# Altium schematic sheet ESP32 with USBC.SchDoc (part 3 of 3)
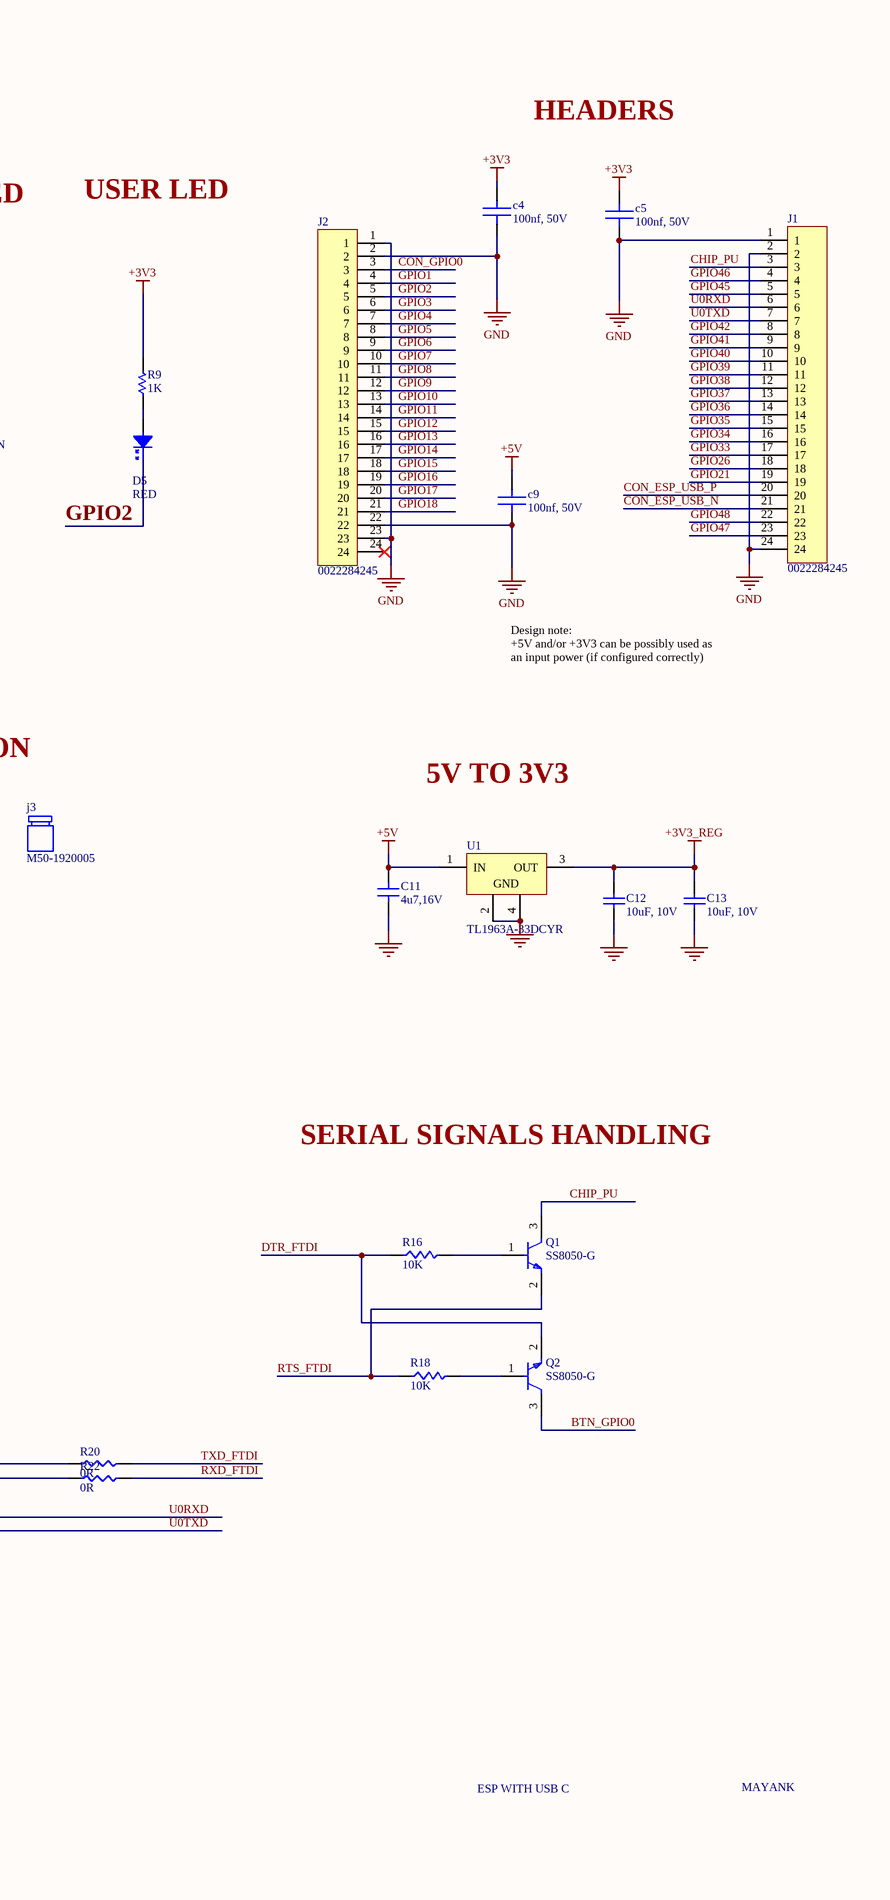
[diagram p3: ESP32 with USBC.SchDoc, right]

## Library data of the parts (continued)
R6 R9 = RC0402FR-071KL: RES 1K OHM 1% 1/16W 0402; Manufacturer: Yageo Group; Value: 1kΩ; Temperature Coefficient: 100ppm/°C; Working Voltage: 50V; Power Rating: 62.5mW; Supplier: DigiKey; Supplier Part Number: 311-1.00KLRDKR-ND; Manufacturer Part Number: RC0402FR-071KL; RoHS: Compliant; Category: Chip SMD Resistors; Stock: 9104095; Pricing: 1=0.1, 10=0.021, 25=0.0152, 50=0.012, 100=0.0097, 250=0.0074, 500=0.00612, 1000=0.00512, 5000=0.00355 (USD); Mounting Technology: Surface Mount; Pins: 2; Case/Package: 0402; Min Operating Temperature: -55°C; Max Operating Temperature: 155°C; Tolerance: 1%; Packaging: Tape & Reel; Termination: SMD/SMT; ComponentLink1URL: https://datasheet.octopart.com:443/RC0402FR-071KL-Yageo-datasheet-175887523.pdf?src-supplier=Newark; ComponentLink1Description: https://datasheet.octopart.com:443/RC0402FR-071KL-Yageo-datasheet-175887523.pdf?src-supplier=Newark; ComponentLink2URL: https://datasheet.octopart.com:443/RC0402FR-071KL-Yageo-datasheet-10408619.pdf?src-supplier=Newark; ComponentLink2Description: https://datasheet.octopart.com:443/RC0402FR-071KL-Yageo-datasheet-10408619.pdf?src-supplier=Newark; ComponentLink3URL: https://datasheet.octopart.com:443/RC0402FR-071KL-Yageo-datasheet-8324527.pdf?src-supplier=Newark; ComponentLink3Description: https://datasheet.octopart.com:443/RC0402FR-071KL-Yageo-datasheet-8324527.pdf?src-supplier=Newark; ComponentLink4URL: https://datasheet.octopart.com:443/RC0402FR-071KL-Yageo-datasheet-164759695.pdf?src-supplier=Upverter; ComponentLink4Description: https://datasheet.octopart.com:443/RC0402FR-071KL-Yageo-datasheet-164759695.pdf?src-supplier=Upverter; ComponentLink5URL: https://datasheet.octopart.com:443/RC0402FR-071KL-Yageo-datasheet-103092701.pdf?src-supplier=Upverter; ComponentLink5Description: https://datasheet.octopart.com:443/RC0402FR-071KL-Yageo-datasheet-103092701.pdf?src-supplier=Upverter; ComponentLink6URL: https://sigma.octopart.com:443/138820526/technical_drawing/Yageo-RC0402FR-071KL.pdf?src-supplier=Upverter; ComponentLink6Description: https://sigma.octopart.com:443/138820526/technical_drawing/Yageo-RC0402FR-071KL.pdf?src-supplier=Upverter; ComponentLink7URL: https://datasheet.octopart.com:443/RC0402FR-071KL-Yageo-datasheet-98239111.pdf?src-supplier=Upverter; ComponentLink7Description: https://datasheet.octopart.com:443/RC0402FR-071KL-Yageo-datasheet-98239111.pdf?src-supplier=Upverter; ComponentLink8URL: https://datasheet.octopart.com:443/RC0402FR-071KL-Yageo-Group-datasheet-190305687.pdf?src-supplier=Future+Electronics; ComponentLink8Description: https://datasheet.octopart.com:443/RC0402FR-071KL-Yageo-Group-datasheet-190305687.pdf?src-supplier=Future+Electronics; LCSC Part Number: C106235; Case Code (Imperial): 0402; Case Code (Metric): 0402; China RoHS: Non-Compliant; Composition: Thick Film; Contact Plating: Tin; Depth: 500µm; Height: 350µm; Lead Free: Lead Free; Length: 1mm; Lifecycle Status: Production; Military Standard: Not; Number of Terminals: 2; Radiation Hardening: No; REACH SVHC: Yes; Schedule B: 8533210045, 8533210045|8533210045|8533210045|8533210045|8533210045|8533210045|8533210045|8533210045|8533210045|8533210045|8533210045|8533210045|8533210045|8533210045|8533210045|8533210045|8533210045|8533210045|8533210045|8533210045|8533210045|8533210045|8533210045|85; Voltage Rating: 50V; Voltage Rating (AC): 50V; Voltage Rating (DC): 50V; Width: 500µm; ComponentLink9URL: https://datasheet.octopart.com:443/RC0402FR-071KL-Yageo-datasheet-12531192.pdf?src-supplier=Future+Electronics; ComponentLink9Description: https://datasheet.octopart.com:443/RC0402FR-071KL-Yageo-datasheet-12531192.pdf?src-supplier=Future+Electronics; ComponentLink10URL: https://datasheet.octopart.com:443/RC0402FR-071KL-Yageo-datasheet-137700087.pdf?src-supplier=Future+Electronics; ComponentLink10Description: https://datasheet.octopart.com:443/RC0402FR-071KL-Yageo-datasheet-137700087.pdf?src-supplier=Future+Electronics; ComponentLink11URL: https://datasheet.octopart.com:443/RC0402FR-071KL-Yageo-datasheet-8324255.pdf?src-supplier=Future+Electronics; ComponentLink11Description: https://datasheet.octopart.com:443/RC0402FR-071KL-Yageo-datasheet-8324255.pdf?src-supplier=Future+Electronics; ComponentLink12URL: https://datasheet.octopart.com:443/RC0402FR-071KL-Yageo-datasheet-62067350.pdf?src-supplier=Farnell; ComponentLink12Description: https://datasheet.octopart.com:443/RC0402FR-071KL-Yageo-datasheet-62067350.pdf?src-supplier=Farnell; ComponentLink13URL: https://datasheet.octopart.com:443/RC0402FR-071KL-Yageo-datasheet-8329306.pdf?src-supplier=element14; ComponentLink13Description: https://datasheet.octopart.com:443/RC0402FR-071KL-Yageo-datasheet-8329306.pdf?src-supplier=element14; ComponentLink14URL: https://datasheet.octopart.com:443/RC0402FR-071KL-Yageo-datasheet-505231.pdf?src-supplier=element14; ComponentLink14Description: https://datasheet.octopart.com:443/RC0402FR-071KL-Yageo-datasheet-505231.pdf?src-supplier=element14; ComponentLink15URL: https://datasheet.octopart.com:443/RC0402FR-071KL-Yageo-datasheet-175423674.pdf?src-supplier=SOS+electronic; ComponentLink15Description: https://datasheet.octopart.com:443/RC0402FR-071KL-Yageo-datasheet-175423674.pdf?src-supplier=SOS+electronic; ComponentLink16URL: https://datasheet.octopart.com:443/RC0402FR-071KL-Yageo-datasheet-148775077.pdf?src-supplier=TME; ComponentLink16Description: https://datasheet.octopart.com:443/RC0402FR-071KL-Yageo-datasheet-148775077.pdf?src-supplier=TME; ComponentLink17URL: https://datasheet.octopart.com:443/RC0402FR-071KL-Yageo-datasheet-79472498.pdf?src-supplier=Megastar; ComponentLink17Description: https://datasheet.octopart.com:443/RC0402FR-071KL-Yageo-datasheet-79472498.pdf?src-supplier=Megastar; ComponentLink18URL: https://datasheet.octopart.com/RC0402FR-071KL-Yageo-datasheet-73766026.pdf; ComponentLink18Description: https://datasheet.octopart.com/RC0402FR-071KL-Yageo-datasheet-73766026.pdf; ComponentLink19URL: http://sigma.octopart.com:80/conflict_mineral_statement/Yageo-company-3.pdf?src-supplier=Compliance+Statements; ComponentLink19Description: http://sigma.octopart.com:80/conflict_mineral_statement/Yageo-company-3.pdf?src-supplier=Compliance+Statements; ComponentLink20URL: http://sigma.octopart.com:80/rohs_statement/Yageo-company-2.pdf?src-supplier=Compliance+Statements; ComponentLink20Description: http://sigma.octopart.com:80/rohs_statement/Yageo-company-2.pdf?src-supplier=Compliance+Statements
R8 = RC0402FR-074K7L: RES 4.7K OHM 1% 1/16W 0402; Manufacturer: Yageo; Additional Feature: LASER TRIMMABLE; Power: 62.5mW; Rated Temperature: 70°C; Value: 4.7kR; Temperature Coefficient: 100ppm/°C; Working Voltage: 50V; Package Height: 0.35mm; Package Length: 1mm; Package Width: 0.5mm; Supplier: Digikey; Supplier Part Number: 311-4.7KLRCT-ND; Manufacturer Part Number: RC0402FR-074K7L; RoHS: Yes; Category: Chip SMD Resistors; Stock: 9886878; Pricing: 1=0.1, 10=0.015, 50=0.0088, 100=0.0073, 500=0.00488, 1000=0.00417, 5000=0.00297 (USD); Mounting Technology: Surface Mount; Pins: 2; Package Shape: Rectangular; Case/Package: 0402; Terminal Finish: Nickel; Min Operating Temperature: -55°C; Max Operating Temperature: 155°C; Tolerance: 1%; JESD-609 Code: e3; Resistor Type: FIXED RESISTOR; Construction: Chip; Package Style: SMTMeter; Packaging: Tape and Reel; Technology: METAL GLAZE/THICK FILM; Termination: Wraparound; Reach SVHC Compliant: Yes; RoHS Compliant: Yes; ComponentLink1URL: https://datasheet.ciiva.com:443/pdfs/VipMasterIC/IC/YAGO/YAGO-S-A0008145938/YAGO-S-A0008145938-1.pdf?src-supplier=IHS+Markit; ComponentLink1Description: https://datasheet.ciiva.com:443/pdfs/VipMasterIC/IC/YAGO/YAGO-S-A0008145938/YAGO-S-A0008145938-1.pdf?src-supplier=IHS+Markit; ComponentLink2URL: https://datasheet.ciiva.com/22661/1686128-22661342.pdf?src-supplier=Element14; ComponentLink2Description: https://datasheet.ciiva.com/22661/1686128-22661342.pdf?src-supplier=Element14; ComponentLink3URL: https://datasheet.ciiva.com/7850/1018594-7850022.pdf?src-supplier=Element14; ComponentLink3Description: https://datasheet.ciiva.com/7850/1018594-7850022.pdf?src-supplier=Element14; ComponentLink4URL: https://datasheet.ciiva.com/7850/1018594-7850023.pdf?src-supplier=Element14; ComponentLink4Description: https://datasheet.ciiva.com/7850/1018594-7850023.pdf?src-supplier=Element14; ComponentLink5URL: https://datasheet.ciiva.com/15215/getdatasheetpartid-328119-15215035.pdf?src-supplier=Verical; ComponentLink5Description: https://datasheet.ciiva.com/15215/getdatasheetpartid-328119-15215035.pdf?src-supplier=Verical; LCSC Part Number: C105871
R10 = AC0402FR-0710KL: RES SMD 10K OHM 1% 1/16W 0402; Manufacturer: Yageo Group; Max Power Dissipation: 63mW; Power Rating: 62.5mW; Value: 10kΩ; Temperature Coefficient: 100ppm/°C; Voltage Rating: 50V; Supplier: DigiKey; Supplier Part Number: YAG3436CT-ND; Manufacturer Part Number: AC0402FR-0710KL; RoHS: Compliant; Category: Chip SMD Resistors; Stock: 147026; Pricing: 1=0.1, 10=0.024, 25=0.0176, 50=0.014, 100=0.0114, 250=0.00876, 500=0.00726, 1000=0.00612, 5000=0.00431 (USD); Case/Package: 0402; Case Code (Imperial): 0402; Case Code (Metric): 1005; China RoHS: Non-Compliant; Composition: Thick Film; Country of Origin: Mainland China, Taiwan; Depth: 500µm; Export Control Classification Number (ECCN) Code: EAR99; Features: Automotive AEC-Q200, Moisture Resistant; Height: 320µm; Harmonized Tariff Schedule (HTS) Code: 8533.21.00.30; Introduction Date: 2012-04-10; Lead Free: Lead Free; Length: 1mm; Lifecycle Status: Production; Max Operating Temperature: 155°C; Military Standard: Not; Min Operating Temperature: -55°C; Mounting Technology: Surface Mount; Number of Terminals: 2; Number of Terminations: 2; Packaging: Tape & Reel; Ratings: AEC-Q200; REACH SVHC: Yes; Schedule B: 8533210045, 8533210045|8533210045|8533210045|8533210045|8533210045|8533210045|8533210045|8533210045|8533210045|8533210045|8533210045|8533210045|8533210045|8533210045|8533210045|8533210045|8533210045|8533210045|8533210045, 8533210045|8533210045|8533210045|8533210045|8533210045|8533210045|8533210045|8533210045|8533210045|8533210045|8533210045|8533210045|8533210045|8533210045|8533210045|8533210045|8533210045|8533210045|8533210045|8533210045|8533210045|8533210045|8533210045|85; Termination: SMD/SMT; Tolerance: 1%; Width: 500µm; Working Voltage: 50V; ComponentLink1URL: https://datasheet.octopart.com:443/AC0402FR-0710KL-Yageo-datasheet-182189377.pdf?src-supplier=IHS; ComponentLink1Description: https://datasheet.octopart.com:443/AC0402FR-0710KL-Yageo-datasheet-182189377.pdf?src-supplier=IHS; ComponentLink2URL: https://datasheet.octopart.com:443/AC0402FR-0710KL-Yageo-datasheet-83209224.pdf?src-supplier=Upverter; ComponentLink2Description: https://datasheet.octopart.com:443/AC0402FR-0710KL-Yageo-datasheet-83209224.pdf?src-supplier=Upverter; ComponentLink3URL: https://datasheet.octopart.com:443/AC0402FR-0710KL-Yageo-datasheet-178509465.pdf?src-supplier=Newark; ComponentLink3Description: https://datasheet.octopart.com:443/AC0402FR-0710KL-Yageo-datasheet-178509465.pdf?src-supplier=Newark; ComponentLink4URL: https://datasheet.octopart.com:443/AC0402FR-0710KL-Yageo-datasheet-166720450.pdf?src-supplier=JRH+Electronics; ComponentLink4Description: https://datasheet.octopart.com:443/AC0402FR-0710KL-Yageo-datasheet-166720450.pdf?src-supplier=JRH+Electronics; ComponentLink5URL: https://datasheet.octopart.com:443/AC0402FR-0710KL-Yageo-datasheet-151884373.pdf?src-supplier=Future+Electronics; ComponentLink5Description: https://datasheet.octopart.com:443/AC0402FR-0710KL-Yageo-datasheet-151884373.pdf?src-supplier=Future+Electronics; ComponentLink6URL: https://datasheet.octopart.com:443/AC0402FR-0710KL-Yageo-Group-datasheet-189830439.pdf?src-supplier=Future+Electronics; ComponentLink6Description: https://datasheet.octopart.com:443/AC0402FR-0710KL-Yageo-Group-datasheet-189830439.pdf?src-supplier=Future+Electronics; ComponentLink7URL: https://datasheet.octopart.com:443/AC0402FR-0710KL-Yageo-datasheet-137699919.pdf?src-supplier=Future+Electronics; ComponentLink7Description: https://datasheet.octopart.com:443/AC0402FR-0710KL-Yageo-datasheet-137699919.pdf?src-supplier=Future+Electronics; ComponentLink8URL: https://datasheet.octopart.com:443/AC0402FR-0710KL-Yageo-datasheet-24580492.pdf?src-supplier=Future+Electronics; ComponentLink8Description: https://datasheet.octopart.com:443/AC0402FR-0710KL-Yageo-datasheet-24580492.pdf?src-supplier=Future+Electronics; ComponentLink9URL: https://datasheet.octopart.com:443/AC0402FR-0710KL-Yageo-datasheet-13029202.pdf?src-supplier=Future+Electronics; ComponentLink9Description: https://datasheet.octopart.com:443/AC0402FR-0710KL-Yageo-datasheet-13029202.pdf?src-supplier=Future+Electronics; ComponentLink10URL: https://datasheet.octopart.com/AC0402FR-0710KL-Yageo-datasheet-12512238.pdf; ComponentLink10Description: https://datasheet.octopart.com/AC0402FR-0710KL-Yageo-datasheet-12512238.pdf; ComponentLink11URL: https://datasheet.octopart.com:443/AC0402FR-0710KL-Yageo-Group-datasheet-164768995.pdf?src-supplier=ODG+(Origin+Data+Global); ComponentLink11Description: https://datasheet.octopart.com:443/AC0402FR-0710KL-Yageo-Group-datasheet-164768995.pdf?src-supplier=ODG+(Origin+Data+Global); ComponentLink12URL: https://datasheet.octopart.com:443/AC0402FR-0710KL-Yageo-datasheet-128677448.pdf?src-supplier=X-ON; ComponentLink12Description: https://datasheet.octopart.com:443/AC0402FR-0710KL-Yageo-datasheet-128677448.pdf?src-supplier=X-ON; ComponentLink13URL: http://sigma.octopart.com:80/conflict_mineral_statement/Yageo-company-3.pdf?src-supplier=Compliance+Statements; ComponentLink13Description: http://sigma.octopart.com:80/conflict_mineral_statement/Yageo-company-3.pdf?src-supplier=Compliance+Statements; ComponentLink14URL: http://sigma.octopart.com:80/rohs_statement/Yageo-company-2.pdf?src-supplier=Compliance+Statements; ComponentLink14Description: http://sigma.octopart.com:80/rohs_statement/Yageo-company-2.pdf?src-supplier=Compliance+Statements; LCSC Part Number: C144807
R11 R16 R18 R19 = AC0402FR-0710KL: RES SMD 10K OHM 1% 1/16W 0402; Manufacturer: Yageo Group; Value: 10kΩ; Temperature Coefficient: 100ppm/°C; Working Voltage: 50V; Max Power Dissipation: 63mW; Power Rating: 62.5mW; Supplier: DigiKey; Supplier Part Number: YAG3436CT-ND; Manufacturer Part Number: AC0402FR-0710KL; RoHS: Compliant; Category: Chip SMD Resistors; Stock: 147026; Pricing: 1=0.1, 10=0.024, 25=0.0176, 50=0.014, 100=0.0114, 250=0.00876, 500=0.00726, 1000=0.00612, 5000=0.00431 (USD); Mounting Technology: Surface Mount; Case/Package: 0402; Min Operating Temperature: -55°C; Max Operating Temperature: 155°C; Tolerance: 1%; Packaging: Tape & Reel; Termination: SMD/SMT; ComponentLink1URL: https://datasheet.octopart.com:443/AC0402FR-0710KL-Yageo-datasheet-182189377.pdf?src-supplier=IHS; ComponentLink1Description: https://datasheet.octopart.com:443/AC0402FR-0710KL-Yageo-datasheet-182189377.pdf?src-supplier=IHS; ComponentLink2URL: https://datasheet.octopart.com:443/AC0402FR-0710KL-Yageo-datasheet-83209224.pdf?src-supplier=Upverter; ComponentLink2Description: https://datasheet.octopart.com:443/AC0402FR-0710KL-Yageo-datasheet-83209224.pdf?src-supplier=Upverter; LCSC Part Number: C144807; Case Code (Imperial): 0402; Case Code (Metric): 1005; China RoHS: Non-Compliant; Composition: Thick Film; Country of Origin: Mainland China, Taiwan; Depth: 500µm; Export Control Classification Number (ECCN) Code: EAR99; Features: Automotive AEC-Q200, Moisture Resistant; Height: 320µm; Harmonized Tariff Schedule (HTS) Code: 8533.21.00.30; Introduction Date: 2012-04-10; Lead Free: Lead Free; Length: 1mm; Lifecycle Status: Production; Military Standard: Not; Number of Terminals: 2; Number of Terminations: 2; Ratings: AEC-Q200; REACH SVHC: Yes; Schedule B: 8533210045, 8533210045|8533210045|8533210045|8533210045|8533210045|8533210045|8533210045|8533210045|8533210045|8533210045|8533210045|8533210045|8533210045|8533210045|8533210045|8533210045|8533210045|8533210045|8533210045, 8533210045|8533210045|8533210045|8533210045|8533210045|8533210045|8533210045|8533210045|8533210045|8533210045|8533210045|8533210045|8533210045|8533210045|8533210045|8533210045|8533210045|8533210045|8533210045|8533210045|8533210045|8533210045|8533210045|85; Voltage Rating: 50V; Width: 500µm; ComponentLink3URL: https://datasheet.octopart.com:443/AC0402FR-0710KL-Yageo-datasheet-178509465.pdf?src-supplier=Newark; ComponentLink3Description: https://datasheet.octopart.com:443/AC0402FR-0710KL-Yageo-datasheet-178509465.pdf?src-supplier=Newark; ComponentLink4URL: https://datasheet.octopart.com:443/AC0402FR-0710KL-Yageo-datasheet-166720450.pdf?src-supplier=JRH+Electronics; ComponentLink4Description: https://datasheet.octopart.com:443/AC0402FR-0710KL-Yageo-datasheet-166720450.pdf?src-supplier=JRH+Electronics; ComponentLink5URL: https://datasheet.octopart.com:443/AC0402FR-0710KL-Yageo-datasheet-151884373.pdf?src-supplier=Future+Electronics; ComponentLink5Description: https://datasheet.octopart.com:443/AC0402FR-0710KL-Yageo-datasheet-151884373.pdf?src-supplier=Future+Electronics; ComponentLink6URL: https://datasheet.octopart.com:443/AC0402FR-0710KL-Yageo-Group-datasheet-189830439.pdf?src-supplier=Future+Electronics; ComponentLink6Description: https://datasheet.octopart.com:443/AC0402FR-0710KL-Yageo-Group-datasheet-189830439.pdf?src-supplier=Future+Electronics; ComponentLink7URL: https://datasheet.octopart.com:443/AC0402FR-0710KL-Yageo-datasheet-137699919.pdf?src-supplier=Future+Electronics; ComponentLink7Description: https://datasheet.octopart.com:443/AC0402FR-0710KL-Yageo-datasheet-137699919.pdf?src-supplier=Future+Electronics; ComponentLink8URL: https://datasheet.octopart.com:443/AC0402FR-0710KL-Yageo-datasheet-24580492.pdf?src-supplier=Future+Electronics; ComponentLink8Description: https://datasheet.octopart.com:443/AC0402FR-0710KL-Yageo-datasheet-24580492.pdf?src-supplier=Future+Electronics; ComponentLink9URL: https://datasheet.octopart.com:443/AC0402FR-0710KL-Yageo-datasheet-13029202.pdf?src-supplier=Future+Electronics; ComponentLink9Description: https://datasheet.octopart.com:443/AC0402FR-0710KL-Yageo-datasheet-13029202.pdf?src-supplier=Future+Electronics; ComponentLink10URL: https://datasheet.octopart.com/AC0402FR-0710KL-Yageo-datasheet-12512238.pdf; ComponentLink10Description: https://datasheet.octopart.com/AC0402FR-0710KL-Yageo-datasheet-12512238.pdf; ComponentLink11URL: https://datasheet.octopart.com:443/AC0402FR-0710KL-Yageo-Group-datasheet-164768995.pdf?src-supplier=ODG+(Origin+Data+Global); ComponentLink11Description: https://datasheet.octopart.com:443/AC0402FR-0710KL-Yageo-Group-datasheet-164768995.pdf?src-supplier=ODG+(Origin+Data+Global); ComponentLink12URL: https://datasheet.octopart.com:443/AC0402FR-0710KL-Yageo-datasheet-128677448.pdf?src-supplier=X-ON; ComponentLink12Description: https://datasheet.octopart.com:443/AC0402FR-0710KL-Yageo-datasheet-128677448.pdf?src-supplier=X-ON; ComponentLink13URL: http://sigma.octopart.com:80/conflict_mineral_statement/Yageo-company-3.pdf?src-supplier=Compliance+Statements; ComponentLink13Description: http://sigma.octopart.com:80/conflict_mineral_statement/Yageo-company-3.pdf?src-supplier=Compliance+Statements; ComponentLink14URL: http://sigma.octopart.com:80/rohs_statement/Yageo-company-2.pdf?src-supplier=Compliance+Statements; ComponentLink14Description: http://sigma.octopart.com:80/rohs_statement/Yageo-company-2.pdf?src-supplier=Compliance+Statements
R12-R15 R17 = AC0402FR-135K1L: Res Thick Film 0402 5.1K Ohm 1% 0.063W(1/16W) ±100ppm/°C Pad SMD T/R Automotive AEC-Q200; Manufacturer: Yageo Group; Power Rating: 62.5mW; Value: 5.1kΩ; Voltage Rating: 50V; Supplier: DigiKey; Supplier Part Number: 13-AC0402FR-135K1LDKR-ND; Manufacturer Part Number: AC0402FR-135K1L; RoHS: Compliant; Category: Chip SMD Resistors; Stock: 116046; Pricing: 1=0.1, 10=0.024, 25=0.0176, 50=0.014, 100=0.0114, 250=0.00876, 500=0.00726, 1000=0.00612, 5000=0.00431 (USD); Case/Package: 0402; China RoHS: Non-Compliant; Composition: Thick Film; Country of Origin: Mainland China, Taiwan; Export Control Classification Number (ECCN) Code: EAR99; Height: 320µm; Harmonized Tariff Schedule (HTS) Code: 8533.21.00.30; Introduction Date: 2012-04-10; Length: 1mm; Lifecycle Status: Production; Max Operating Temperature: 155°C; Min Operating Temperature: -55°C; Mounting Technology: Surface Mount; Number of Terminals: 2; Packaging: Tape & Reel; Ratings: AEC-Q200; REACH SVHC: Yes; Temperature Coefficient: 100ppm/°C; Tolerance: 1%; Width: 500µm; Working Voltage: 50V; ComponentLink1URL: https://datasheet.octopart.com:443/AC0402FR-135K1L-Yageo-datasheet-182189377.pdf?src-supplier=IHS; ComponentLink1Description: https://datasheet.octopart.com:443/AC0402FR-135K1L-Yageo-datasheet-182189377.pdf?src-supplier=IHS; ComponentLink2URL: https://datasheet.octopart.com:443/AC0402FR-135K1L-Yageo-datasheet-83209224.pdf?src-supplier=Upverter; ComponentLink2Description: https://datasheet.octopart.com:443/AC0402FR-135K1L-Yageo-datasheet-83209224.pdf?src-supplier=Upverter; ComponentLink3URL: https://datasheet.octopart.com:443/AC0402FR-135K1L-Yageo-Group-datasheet-189830439.pdf?src-supplier=Future+Electronics; ComponentLink3Description: https://datasheet.octopart.com:443/AC0402FR-135K1L-Yageo-Group-datasheet-189830439.pdf?src-supplier=Future+Electronics; ComponentLink4URL: https://datasheet.octopart.com:443/AC0402FR-135K1L-Yageo-datasheet-166720450.pdf?src-supplier=Future+Electronics; ComponentLink4Description: https://datasheet.octopart.com:443/AC0402FR-135K1L-Yageo-datasheet-166720450.pdf?src-supplier=Future+Electronics; ComponentLink5URL: https://datasheet.octopart.com:443/AC0402FR-135K1L-Yageo-datasheet-164768995.pdf?src-supplier=Future+Electronics; ComponentLink5Description: https://datasheet.octopart.com:443/AC0402FR-135K1L-Yageo-datasheet-164768995.pdf?src-supplier=Future+Electronics; ComponentLink6URL: https://datasheet.octopart.com/AC0402FR-135K1L-Yageo-datasheet-12512238.pdf; ComponentLink6Description: https://datasheet.octopart.com/AC0402FR-135K1L-Yageo-datasheet-12512238.pdf; ComponentLink7URL: http://sigma.octopart.com:80/conflict_mineral_statement/Yageo-company-3.pdf?src-supplier=Compliance+Statements; ComponentLink7Description: http://sigma.octopart.com:80/conflict_mineral_statement/Yageo-company-3.pdf?src-supplier=Compliance+Statements; ComponentLink8URL: http://sigma.octopart.com:80/rohs_statement/Yageo-company-2.pdf?src-supplier=Compliance+Statements; ComponentLink8Description: http://sigma.octopart.com:80/rohs_statement/Yageo-company-2.pdf?src-supplier=Compliance+Statements; LCSC Part Number: C226739
SW1 SW2 = PTS645SH50SMTR92LFS: SWITCH TACTILE SPST-NO 0.05A 12V; Manufacturer: C&K Components; Contact Resistance: 100mΩ; Electrical Life: 100kcycles; Insulation Resistance: 100GΩ; Switch Function: Off-Mom; Actuator Material: Nylon, Polyamide; Contact Current Rating: 50mA; Illumination Type: Illuminated, Non-Illuminated; Number of Positions: 1; Operating Force: 1.96N; Throw Configuration: SPST; Supplier: DigiKey; Supplier Part Number: CKN9085CT-ND; Manufacturer Part Number: PTS645SH50SMTR92LFS; RoHS: Compliant; Category: Tactile Switches; Stock: 46479; Pricing: 1=0.36, 10=0.312, 25=0.2912, 100=0.2606, 250=0.24148, 500=0.2279 (USD); Mounting Technology: Surface Mount; Min Operating Temperature: -20°C; Max Operating Temperature: 60°C; Termination: Gull Wing; ComponentLink1URL: https://datasheet.octopart.com:443/PTS645SH50SMTR92LFS-C%26K-Components-datasheet-169841344.pdf?src-supplier=Farnell; ComponentLink1Description: https://datasheet.octopart.com:443/PTS645SH50SMTR92LFS-C%26K-Components-datasheet-169841344.pdf?src-supplier=Farnell; ComponentLink2URL: https://datasheet.octopart.com:443/PTS645SH50SMTR92LFS-C%26K-Components-datasheet-165782998.pdf?src-supplier=Farnell; ComponentLink2Description: https://datasheet.octopart.com:443/PTS645SH50SMTR92LFS-C%26K-Components-datasheet-165782998.pdf?src-supplier=Farnell; ComponentLink3URL: https://datasheet.octopart.com:443/PTS645SH50SMTR92LFS-C%26K-Components-datasheet-67873720.pdf?src-supplier=Upverter; ComponentLink3Description: https://datasheet.octopart.com:443/PTS645SH50SMTR92LFS-C%26K-Components-datasheet-67873720.pdf?src-supplier=Upverter; ComponentLink4URL: https://datasheet.octopart.com:443/PTS645SH50SMTR92-LFS-C%26K-Components-datasheet-141421486.pdf?src-supplier=Upverter; ComponentLink4Description: https://datasheet.octopart.com:443/PTS645SH50SMTR92-LFS-C%26K-Components-datasheet-141421486.pdf?src-supplier=Upverter; LCSC Part Number: C221869; Case/Package: SMD/SMT; Color: Black; Contact Material: Bronze; Contact Plating: Silver; Country of Origin: Mainland China; Current Rating: 50mA; Depth: 9mm; Export Control Classification Number (ECCN) Code: EAR99; Height: 3.4544mm; Harmonized Tariff Schedule (HTS) Code: 8536.50.90.40; Introduction Date: 2013-05-01; Lead Free: Lead Free; Length: 6mm; Life (Cycles): 100kcycles; Lifecycle Status: Production; Max Current Rating: 50mA; Max Voltage Rating (DC): 12V; Mechanical Life: 100kcycles; Orientation: Straight; Packaging: Tape & Reel (TR); REACH SVHC: Yes; Voltage Rating (DC): 12V; ComponentLink5URL: https://datasheet.octopart.com:443/PTS645SH50SMTR92-LFS-C%26K-Components-datasheet-110647872.pdf?src-supplier=TME; ComponentLink5Description: https://datasheet.octopart.com:443/PTS645SH50SMTR92-LFS-C%26K-Components-datasheet-110647872.pdf?src-supplier=TME; ComponentLink6URL: https://datasheet.octopart.com:443/PTS645SH50SMTR-92-LFS-C%26K-Components-datasheet-150821959.pdf?src-supplier=TME; ComponentLink6Description: https://datasheet.octopart.com:443/PTS645SH50SMTR-92-LFS-C%26K-Components-datasheet-150821959.pdf?src-supplier=TME; ComponentLink7URL: https://datasheet.octopart.com:443/PTS645SH50SMTR92LFS-C%26K-Components-datasheet-138128951.pdf?src-supplier=Future+Electronics; ComponentLink7Description: https://datasheet.octopart.com:443/PTS645SH50SMTR92LFS-C%26K-Components-datasheet-138128951.pdf?src-supplier=Future+Electronics; ComponentLink8URL: https://datasheet.octopart.com:443/PTS645SH50SMTR92LFS-C%26K-Components-datasheet-62111174.pdf?src-supplier=Future+Electronics; ComponentLink8Description: https://datasheet.octopart.com:443/PTS645SH50SMTR92LFS-C%26K-Components-datasheet-62111174.pdf?src-supplier=Future+Electronics; ComponentLink9URL: https://datasheet.octopart.com:443/PTS645SH50SMTR92LFS-C%26K-Components-datasheet-24578962.pdf?src-supplier=Future+Electronics; ComponentLink9Description: https://datasheet.octopart.com:443/PTS645SH50SMTR92LFS-C%26K-Components-datasheet-24578962.pdf?src-supplier=Future+Electronics; ComponentLink10URL: https://datasheet.octopart.com:443/PTS645SH50SMTR92-LFS-C%26K-Components-datasheet-12590747.pdf?src-supplier=Future+Electronics; ComponentLink10Description: https://datasheet.octopart.com:443/PTS645SH50SMTR92-LFS-C%26K-Components-datasheet-12590747.pdf?src-supplier=Future+Electronics
U1 = TL1963A-33DCYR: IC REG LIN 3.3V 1.5A SOT-223-4; Manufacturer: Texas Instruments; Manufacturer Lifecycle Status: ACTIVE; Max Supply Voltage: 20V; Min Input Voltage: 2.1V; Number of Outputs: 1; Accuracy: 3%; Dropout Voltage: 340mV; Input Bias Current: 1mA; Min Current Limit: 1.6A; Output Type: Fixed; Polarity: Positive; Supplier: DigiKey; Supplier Part Number: 296-24897-1-ND; Manufacturer Part Number: TL1963A-33DCYR; RoHS: Compliant; Category: LDO Voltage Regulators; Stock: 3442; Pricing: 1=3.22, 10=2.414, 25=2.212, 100=1.9903, 250=1.88444, 500=1.85588 (USD); Case/Package: SOT-223; Pins: 4; Length: 6.5mm; Width: 3.5mm; ComponentLink1URL: https://datasheet.octopart.com:443/TL1963A-33DCYR-Texas-Instruments-datasheet-36835243.pdf?src-supplier=Texas+Instruments; ComponentLink1Description: https://datasheet.octopart.com:443/TL1963A-33DCYR-Texas-Instruments-datasheet-36835243.pdf?src-supplier=Texas+Instruments; ComponentLink2URL: https://octopart.com:443/opatz8j6/c1?t=FTrSVOfP93nAUGvhjd3lhUGXAEiGpl01rJ-ejAqOdcBDFpYGu16XhNrkZ_g2C1wXYKFanKCfwKRpWqlBzC_IHFKOGMjjJUz2d1twI7R59KZfH-bxvJsXWw8-WulKPBbWwnOyaMw2-C-0Sp5V4W6xJGBv4vK90Jv7smY0K_a7ljXNSAI5u-7HaSWygK100XGEoHxm-1Tumi5wx4eug8BBO_Pe_nHVi4GorIiLyPu5vhCD6EzPrS-RGOe1pMk-F4S1gCCkV4ICNxEwYq2RWn6io-0ATlLiT5xzDyADfsSG4dajJZfl1C1Okxj7teHxMQUy64jRct2yicJxlEVSLY6XZqKQmY9qnFKjTONJcbedCy28GSU6Pz2CwzNsodNFiDHj97FWGx4&src-supplier=Texas+Instruments; ComponentLink2Description: https://octopart.com:443/opatz8j6/c1?t=FTrSVOfP93nAUGvhjd3lhUGXAEiGpl01rJ-ejAqOdcBDFpYGu16XhNrkZ_g2C1wXYKFanKCfwKRpWqlBzC_IHFKOGMjjJUz2d1twI7R59KZfH-bxvJsXWw8-WulKPBbWwnOyaMw2-C-0Sp5V4W6xJGBv4vK90Jv7smY0K_a7ljXNSAI5u-7HaSWygK100XGEoHxm-1Tumi5wx4eug8BBO_Pe_nHVi4GorIiLyPu5vhCD6EzPrS-RGOe1pMk-F4S1gCCkV4ICNxEwYq2RWn6io-0ATlLiT5xzDyADfsSG4dajJZfl1C1Okxj7teHxMQUy64jRct2yicJxlEVSLY6XZqKQmY9qnFKjTONJcbedCy28GSU6Pz2CwzNsodNFiDHj97FWGx4&src-supplier=Texas+Instruments; LCSC Part Number: C181262; Contact Plating: Tin; Height: 1.8mm; Lead Free: Lead Free; Lifecycle Status: Production; Max Operating Temperature: 125°C; Max Output current: 1.5A; Max Output Voltage: 3.3V; Min Operating Temperature: -40°C; Min Output Voltage: 3.3V; Nominal Output Voltage: 3.3V; Number of Regulators: 1; Output Current: 1.5A; Output Voltage: 3.3V; Quiescent Current: 1mA; Radiation Hardening: No; REACH SVHC: No; Schedule B: 8542390000, 8542390000|8542390000|8542390000|8542390000|8542390000; Thickness: 1.6mm; ComponentLink3URL: https://datasheet.octopart.com:443/TL1963A-33DCYR-Texas-Instruments-datasheet-10255270.pdf?src-supplier=Texas+Instruments; ComponentLink3Description: https://datasheet.octopart.com:443/TL1963A-33DCYR-Texas-Instruments-datasheet-10255270.pdf?src-supplier=Texas+Instruments; ComponentLink4URL: https://sigma.octopart.com:443/49253063/technical_drawing/Texas-Instruments-TL1963A-33DCYR.pdf?src-supplier=Texas+Instruments; ComponentLink4Description: https://sigma.octopart.com:443/49253063/technical_drawing/Texas-Instruments-TL1963A-33DCYR.pdf?src-supplier=Texas+Instruments; ComponentLink5URL: https://datasheet.octopart.com:443/TL1963A-33DCYR-Texas-Instruments-datasheet-159117591.pdf?src-supplier=Augswan; ComponentLink5Description: https://datasheet.octopart.com:443/TL1963A-33DCYR-Texas-Instruments-datasheet-159117591.pdf?src-supplier=Augswan; ComponentLink6URL: https://datasheet.octopart.com:443/TL1963A-33DCYR-Texas-Instruments-datasheet-21820479.pdf?src-supplier=Newark; ComponentLink6Description: https://datasheet.octopart.com:443/TL1963A-33DCYR-Texas-Instruments-datasheet-21820479.pdf?src-supplier=Newark; ComponentLink7URL: https://datasheet.octopart.com:443/TL1963A-33DCYR-Texas-Instruments-datasheet-16079880.pdf?src-supplier=Farnell; ComponentLink7Description: https://datasheet.octopart.com:443/TL1963A-33DCYR-Texas-Instruments-datasheet-16079880.pdf?src-supplier=Farnell; ComponentLink8URL: https://datasheet.octopart.com:443/TL1963A-33DCYR-Texas-Instruments-datasheet-14171511.pdf?src-supplier=iiiC; ComponentLink8Description: https://datasheet.octopart.com:443/TL1963A-33DCYR-Texas-Instruments-datasheet-14171511.pdf?src-supplier=iiiC; ComponentLink9URL: http://sigma.octopart.com:80/conflict_mineral_statement/Texas-Instruments-company-63.pdf?src-supplier=Compliance+Statements; ComponentLink9Description: http://sigma.octopart.com:80/conflict_mineral_statement/Texas-Instruments-company-63.pdf?src-supplier=Compliance+Statements; ComponentLink10URL: http://sigma.octopart.com:80/reach_statement/Texas-Instruments-company-64.pdf?src-supplier=Compliance+Statements; ComponentLink10Description: http://sigma.octopart.com:80/reach_statement/Texas-Instruments-company-64.pdf?src-supplier=Compliance+Statements
U*1 = FT231XQ-R: IC USB SERIAL FULL UART 20QFN; Manufacturer: FTDI; Data Rate: 12Mbps; Interface: UART, USB; Max Supply Current: 8.4mA; Max Supply Voltage: 5.5V; Min Supply Voltage: 2.97V; Nominal Supply Voltage (DC): 5V; Number of Channels: 1; Operating Supply Current: 8mA; Supplier: DigiKey; Supplier Part Number: 768-1128-6-ND; Manufacturer Part Number: FT231XQ-R; RoHS: Compliant; Category: UART Interface ICs; Pricing: 1=2.34, 25=2.27, 100=2.2, 250=2.15728 (USD); Ambient Temperature Range High: 85°C; Case/Package: QFN; Height: 800µm; Height - Seated (Max): 800µm; Lead Free: Lead Free; Length: 4mm; Lifecycle Status: Production; Max Operating Temperature: 85°C; Min Operating Temperature: -40°C; Mounting Technology: Surface Mount; Pins: 20; Number of Terminals: 20; REACH SVHC: Yes; Terminal Pitch: 500µm; Weight: 123.008581mg; Width: 4mm; ComponentLink1URL: https://datasheet.octopart.com:443/FT231XQ-R-FTDI-datasheet-182343132.pdf?src-supplier=IHS; ComponentLink1Description: https://datasheet.octopart.com:443/FT231XQ-R-FTDI-datasheet-182343132.pdf?src-supplier=IHS; ComponentLink2URL: https://datasheet.octopart.com:443/FT231XQ-R-FTDI-datasheet-11021087.pdf?src-supplier=HQonline; ComponentLink2Description: https://datasheet.octopart.com:443/FT231XQ-R-FTDI-datasheet-11021087.pdf?src-supplier=HQonline; ComponentLink3URL: https://datasheet.octopart.com:443/FT231XQ-R-FTDI-datasheet-28834672.pdf?src-supplier=SOS+electronic; ComponentLink3Description: https://datasheet.octopart.com:443/FT231XQ-R-FTDI-datasheet-28834672.pdf?src-supplier=SOS+electronic; ComponentLink4URL: https://datasheet.octopart.com:443/FT231XQ-R-FTDI-datasheet-68321328.pdf?src-supplier=TME; ComponentLink4Description: https://datasheet.octopart.com:443/FT231XQ-R-FTDI-datasheet-68321328.pdf?src-supplier=TME; ComponentLink5URL: https://datasheet.octopart.com:443/FT231XQ-R-FTDI-datasheet-134530624.pdf?src-supplier=SHENGYU+ELECTRONICS; ComponentLink5Description: https://datasheet.octopart.com:443/FT231XQ-R-FTDI-datasheet-134530624.pdf?src-supplier=SHENGYU+ELECTRONICS; LCSC Part Number: C132159
u*2 = ESP32-S3-MINI-1-N8: SMD module, ESP32-S3FN8, 8 MB SPI flash, PCB antenna; Manufacturer: Espressif Systems; Supplier: DigiKey; Supplier Part Number: 5407-ESP32-S3-MINI-1-N8CT-ND; Manufacturer Part Number: ESP32-S3-MINI-1-N8; RoHS: Compliant; Category: RF Transceiver Modules and Modems; Stock: 6044; Pricing: 1=5.43, 10=4.703, 25=4.4492, 100=4.0995, 250=3.89008, 650=3.68846, 1300=3.55221, 1950=3.47622 (USD); ComponentLink1URL: https://datasheet.octopart.com:443/ESP32-S3-MINI-1-N8-Espressif-Systems-datasheet-188867343.pdf?src-supplier=TME; ComponentLink1Description: https://datasheet.octopart.com:443/ESP32-S3-MINI-1-N8-Espressif-Systems-datasheet-188867343.pdf?src-supplier=TME; ComponentLink2URL: https://datasheet.octopart.com:443/ESP32-S3-MINI-1-N8-Espressif-Systems-datasheet-165560562.pdf?src-supplier=TME; ComponentLink2Description: https://datasheet.octopart.com:443/ESP32-S3-MINI-1-N8-Espressif-Systems-datasheet-165560562.pdf?src-supplier=TME; ComponentLink3URL: https://datasheet.octopart.com:443/ESP32-S3-MINI-1-N8-Espressif-Systems-datasheet-165560559.pdf?src-supplier=TME; ComponentLink3Description: https://datasheet.octopart.com:443/ESP32-S3-MINI-1-N8-Espressif-Systems-datasheet-165560559.pdf?src-supplier=TME; ComponentLink4URL: https://datasheet.octopart.com:443/ESP32-S3-MINI-1-N8-Espressif-Systems-datasheet-192318068.pdf?src-supplier=HQonline; ComponentLink4Description: https://datasheet.octopart.com:443/ESP32-S3-MINI-1-N8-Espressif-Systems-datasheet-192318068.pdf?src-supplier=HQonline; LCSC Part Number: C2913206